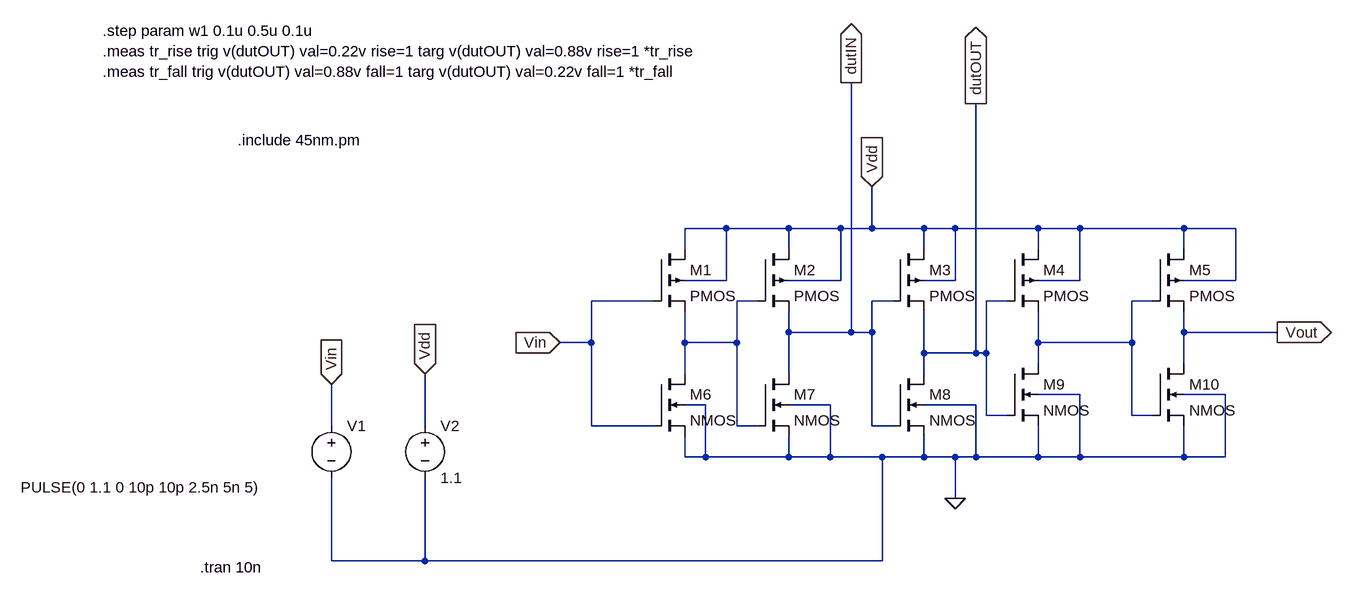
[diagram p0: schematic hw1-sizing.asc]
hw1-sizing.asc, the LTspice schematic file:
Version 4
SHEET 1 880 680
WIRE -176 48 -240 48
WIRE -80 48 -176 48
WIRE 0 48 -80 48
WIRE 48 48 48 -16
WIRE 48 48 0 48
WIRE 128 48 48 48
WIRE 176 48 128 48
WIRE 304 48 176 48
WIRE 368 48 304 48
WIRE 528 48 368 48
WIRE 608 48 528 48
WIRE -240 80 -240 48
WIRE -80 80 -80 48
WIRE 128 80 128 48
WIRE 304 80 304 48
WIRE 528 80 528 48
WIRE -176 128 -176 48
WIRE -176 128 -240 128
WIRE 0 128 0 48
WIRE 0 128 -80 128
WIRE 176 128 176 48
WIRE 176 128 128 128
WIRE 368 128 368 48
WIRE 368 128 304 128
WIRE 608 128 608 48
WIRE 608 128 528 128
WIRE -288 160 -384 160
WIRE -128 160 -160 160
WIRE 80 160 48 160
WIRE 256 160 224 160
WIRE 480 160 448 160
WIRE -80 208 -80 176
WIRE 16 208 16 -176
WIRE 16 208 -80 208
WIRE 48 208 48 160
WIRE 48 208 16 208
WIRE 528 208 528 176
WIRE 672 208 528 208
WIRE -384 224 -384 160
WIRE -384 224 -432 224
WIRE -240 224 -240 176
WIRE -160 224 -160 160
WIRE -160 224 -240 224
WIRE 304 224 304 176
WIRE 448 224 448 160
WIRE 448 224 304 224
WIRE 128 240 128 176
WIRE 208 240 208 -144
WIRE 208 240 128 240
WIRE 224 240 224 160
WIRE 224 240 208 240
WIRE 304 256 304 224
WIRE 528 256 528 208
WIRE -240 272 -240 224
WIRE -80 272 -80 208
WIRE 128 272 128 240
WIRE 368 304 304 304
WIRE 592 304 528 304
WIRE -208 320 -240 320
WIRE -16 320 -80 320
WIRE 208 320 128 320
WIRE 224 336 224 240
WIRE 256 336 224 336
WIRE 448 336 448 224
WIRE 480 336 448 336
WIRE -784 352 -784 288
WIRE -640 352 -640 272
WIRE -384 352 -384 224
WIRE -288 352 -384 352
WIRE -160 352 -160 224
WIRE -128 352 -160 352
WIRE 48 352 48 208
WIRE 80 352 48 352
WIRE -240 400 -240 368
WIRE -208 400 -208 320
WIRE -208 400 -240 400
WIRE -80 400 -80 368
WIRE -80 400 -208 400
WIRE -16 400 -16 320
WIRE -16 400 -80 400
WIRE 64 400 -16 400
WIRE 128 400 128 368
WIRE 128 400 64 400
WIRE 176 400 128 400
WIRE 208 400 208 320
WIRE 208 400 176 400
WIRE 304 400 304 352
WIRE 304 400 208 400
WIRE 368 400 368 304
WIRE 368 400 304 400
WIRE 528 400 528 352
WIRE 528 400 368 400
WIRE 592 400 592 304
WIRE 592 400 528 400
WIRE 176 464 176 400
WIRE -784 560 -784 432
WIRE -640 560 -640 432
WIRE -640 560 -784 560
WIRE 64 560 64 400
WIRE 64 560 -640 560
FLAG 48 -16 Vdd
IOPIN 48 -16 In
FLAG -432 224 Vin
IOPIN -432 224 In
FLAG 176 464 0
FLAG 672 208 Vout
IOPIN 672 208 Out
FLAG -784 288 Vin
IOPIN -784 288 In
FLAG -640 272 Vdd
IOPIN -640 272 In
FLAG 16 -176 dutIN
IOPIN 16 -176 Out
FLAG 208 -144 dutOUT
IOPIN 208 -144 Out
SYMBOL pmos4 -288 80 R0
SYMATTR InstName M1
SYMATTR Value2 l=45n w={w1}
SYMBOL pmos4 -128 80 R0
SYMATTR InstName M2
SYMATTR Value2 l=45n w={w1} m=4
SYMBOL pmos4 80 80 R0
SYMATTR InstName M3
SYMATTR Value2 l=45n w={w1} m=16
SYMBOL pmos4 256 80 R0
SYMATTR InstName M4
SYMATTR Value2 l=45n w={w1} m=64
SYMBOL pmos4 480 80 R0
SYMATTR InstName M5
SYMATTR Value2 l=45n w={w1} m=256
SYMBOL nmos4 -288 272 R0
SYMATTR InstName M6
SYMATTR Value2 l=45n w=0.2u
SYMBOL nmos4 -128 272 R0
SYMATTR InstName M7
SYMATTR Value2 l=45n w=0.2u m=4
SYMBOL nmos4 80 272 R0
SYMATTR InstName M8
SYMATTR Value2 l=45n w=0.2u m=16
SYMBOL nmos4 256 256 R0
SYMATTR InstName M9
SYMATTR Value2 l=45n w=0.2u m=64
SYMBOL nmos4 480 256 R0
SYMATTR InstName M10
SYMATTR Value2 l=45n w=0.2u m=256
SYMBOL voltage -784 336 R0
WINDOW 123 0 0 Left 0
WINDOW 39 0 0 Left 0
WINDOW 3 -478 111 Left 2
SYMATTR InstName V1
SYMATTR Value PULSE(0 1.1 0 10p 10p 2.5n 5n 5)
SYMBOL voltage -640 336 R0
WINDOW 123 0 0 Left 0
WINDOW 39 0 0 Left 0
SYMATTR InstName V2
SYMATTR Value 1.1
TEXT -928 -88 Left 2 !.include 45nm.pm
TEXT -1136 -256 Left 2 !.step param w1 0.1u 0.5u 0.1u\n.meas tr_rise trig v(dutOUT) val=0.22v rise=1 targ v(dutOUT) val=0.88v rise=1 *tr_rise\n.meas tr_fall trig v(dutOUT) val=0.88v fall=1 targ v(dutOUT) val=0.22v fall=1 *tr_fall
TEXT -986 570 Left 2 !.tran 10n

The netlist it stands for:
* hw1-sizing.asc
M1 Vdd Vin N001 Vdd PMOS l=45n w={w1}
M2 Vdd N001 dutIN Vdd PMOS l=45n w={w1} m=4
M3 Vdd dutIN dutOUT Vdd PMOS l=45n w={w1} m=16
M4 Vdd dutOUT N002 Vdd PMOS l=45n w={w1} m=64
M5 Vdd N002 Vout Vdd PMOS l=45n w={w1} m=256
M6 N001 Vin 0 0 NMOS l=45n w=0.2u
M7 dutIN N001 0 0 NMOS l=45n w=0.2u m=4
M8 dutOUT dutIN 0 0 NMOS l=45n w=0.2u m=16
M9 N002 dutOUT 0 0 NMOS l=45n w=0.2u m=64
M10 Vout N002 0 0 NMOS l=45n w=0.2u m=256
V1 Vin 0 PULSE(0 1.1 0 10p 10p 2.5n 5n 5)
V2 Vdd 0 1.1
.model NMOS NMOS
.model PMOS PMOS
.lib standard.mos
.include 45nm.pm
.step param w1 0.1u 0.5u 0.1u
.meas tr_rise trig v(dutOUT) val=0.22v rise=1 targ v(dutOUT) val=0.88v rise=1 *tr_rise
.meas tr_fall trig v(dutOUT) val=0.88v fall=1 targ v(dutOUT) val=0.22v fall=1 *tr_fall
.tran 10n
.backanno
.end